# Altium schematic sheet [7]Halleffec.SchDoc
size B
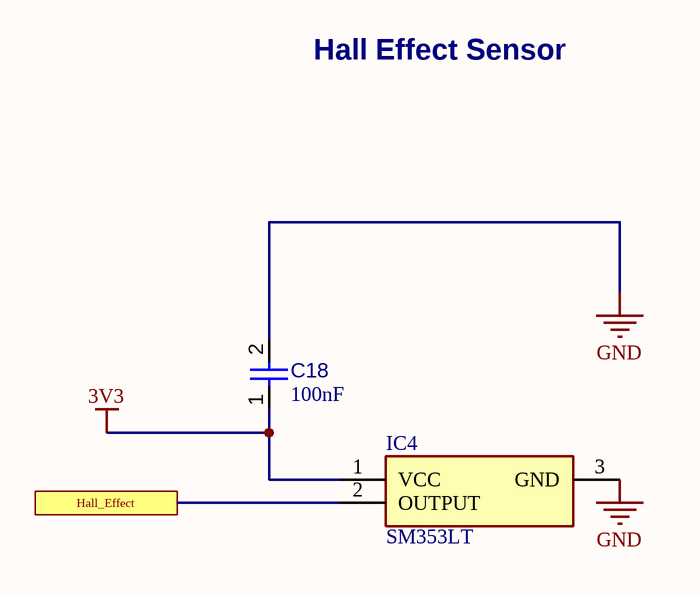
[diagram p0: [7]Halleffec.SchDoc]

## Parts
C18  value 100nF  [CAPC1608X90X40ML10T20]  (hidden comment: Capacitor 100 nF +/-10% 50 V 0603)
IC4  SM353LT  [SOT95P280X145-3N]

## Ports
Hall_Effect

## Nets
3V3: C18.1 IC4.1(VCC)
GND: C18.2 IC4.3(GND)
Hall_Effect: IC4.2(OUTPUT) ; port Hall_Effect

## Notes on the sheet
- Hall Effect Sensor

## Library data of the parts
C18 = CMP-001-00017-4: Chip Capacitor, 100 nF, +/- 10%, 50 V, 0603 (1608 Metric); Capacitor Type: Ceramic; Voltage Rating: 50V; RoHS Compliant: True; Max Operating Temperature: 125°C; Pins: 2; Mounting Technology: SM; Min Operating Temperature: -55°C; Tolerance: 10%; Case/Package: 0603
IC4 = SM353LT: Integrated Circuit; Manufacturer_Name: Honeywell; Datasheet Link: http://uk.rs-online.com/web/p/products/8252612; Height: 1.45mm; Manufacturer_Part_Number: SM353LT; Arrow Part Number: SM353LT; Arrow Price/Stock: https://www.arrow.com/en/products/sm353lt/honeywell; Mouser Part Number: 785-SM353LT; Mouser Price/Stock: https://www.mouser.co.uk/ProductDetail/Honeywell/SM353LT?qs=sJdZgDoFdSW3aINL1oUyuA%3D%3D; ComponentLink1Description: documentation; ComponentLink1URL: http://www.farnell.com/datasheets/2012450.pdf?_ga=2.245790722.741299232.1603476058-140605836.1598371586&_gac=1.141304070.1603476058.EAIaIQobChMItI734qXL7AIVmRatBh3JPwF_EAAYAiAAEgIk7PD_BwE